# EasyEDA Pro project 学期项目.epro, schematic Schematic2

## Sheets
1 P1: Assembly Variant: Basic; Board Name: Board2; Create Date: 2026-04-07; Page Name: P1; Project Name: 学期项目_2026-03-26_14-34-54; Schematic Name: Schematic2; Update Date: 2026-04-07; BladeWidth: 10; Company: 嘉立创EDA; Page Size: A4; RegionStart: 1; ShowBorder: 1; TitleBlock: 1; TitleBlockPosition: 3; Version: V1.0; XRegionCount: 6; YRegionCount: 4
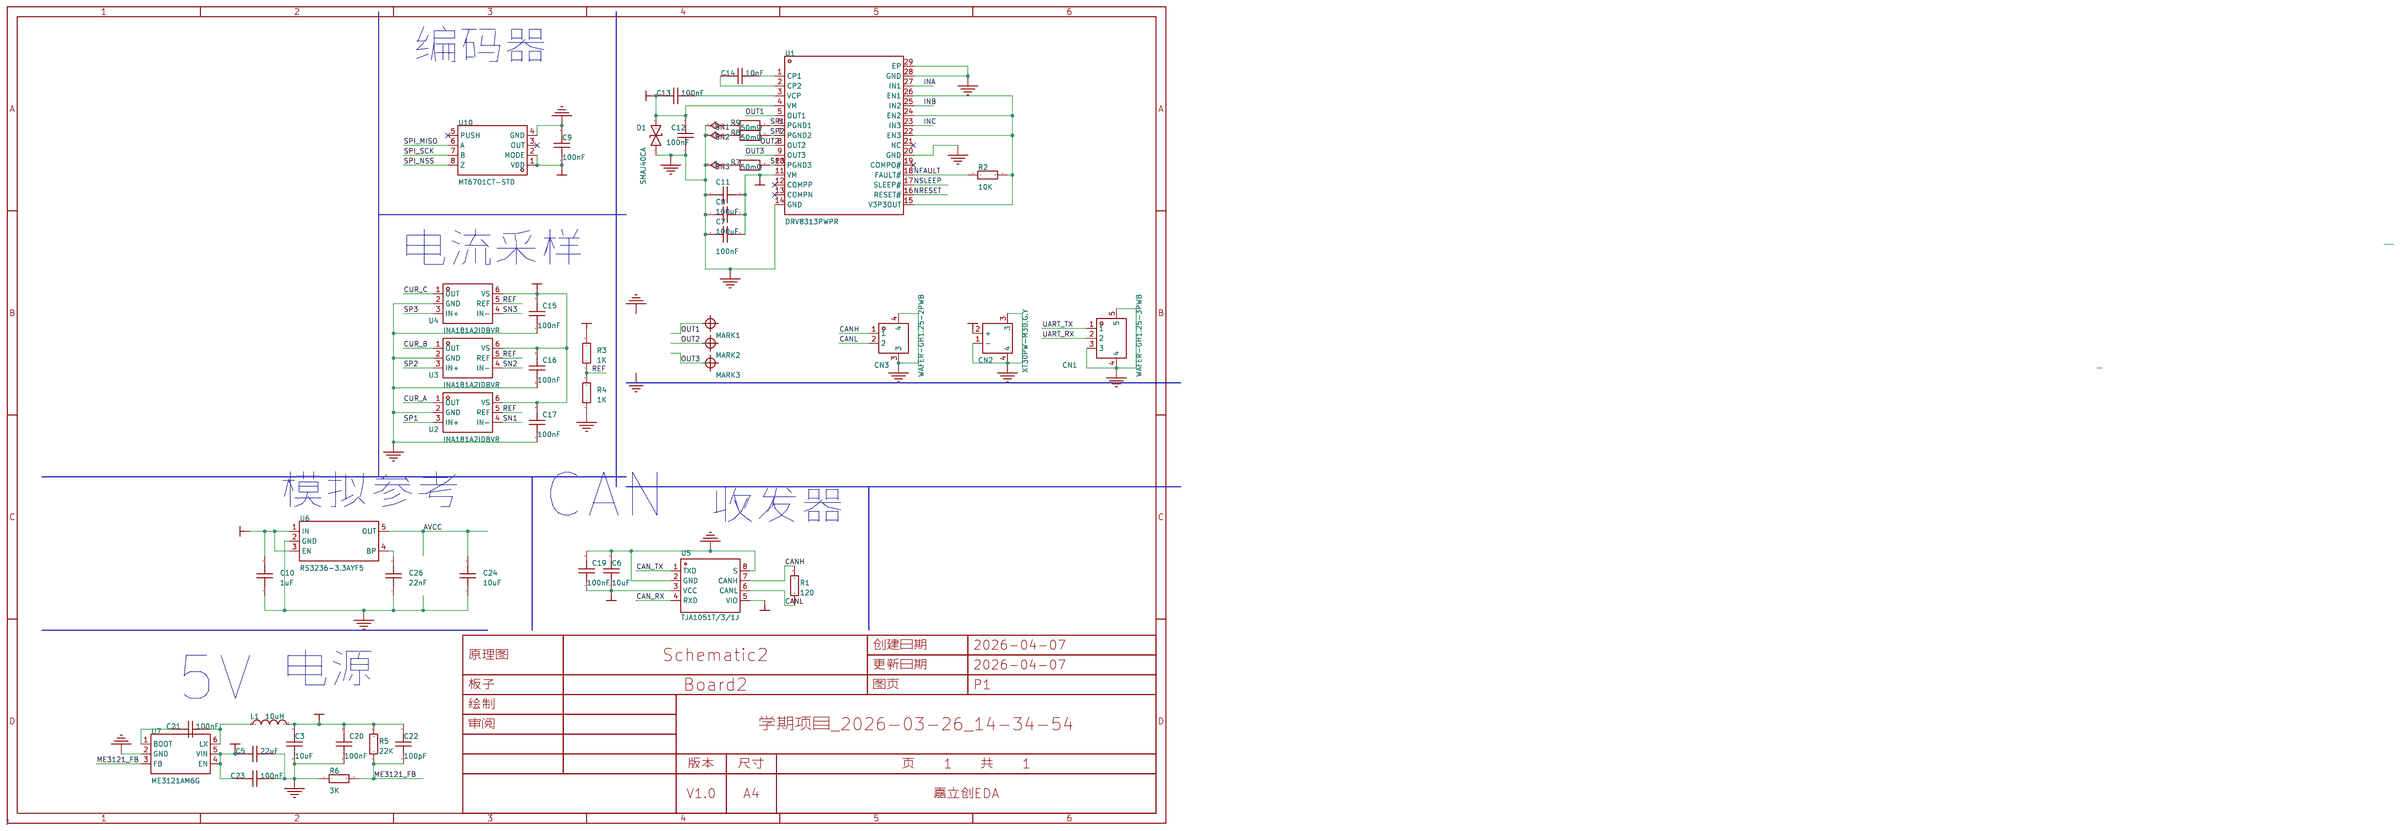
[diagram p6: P1]
2 P3: Page Name: P3
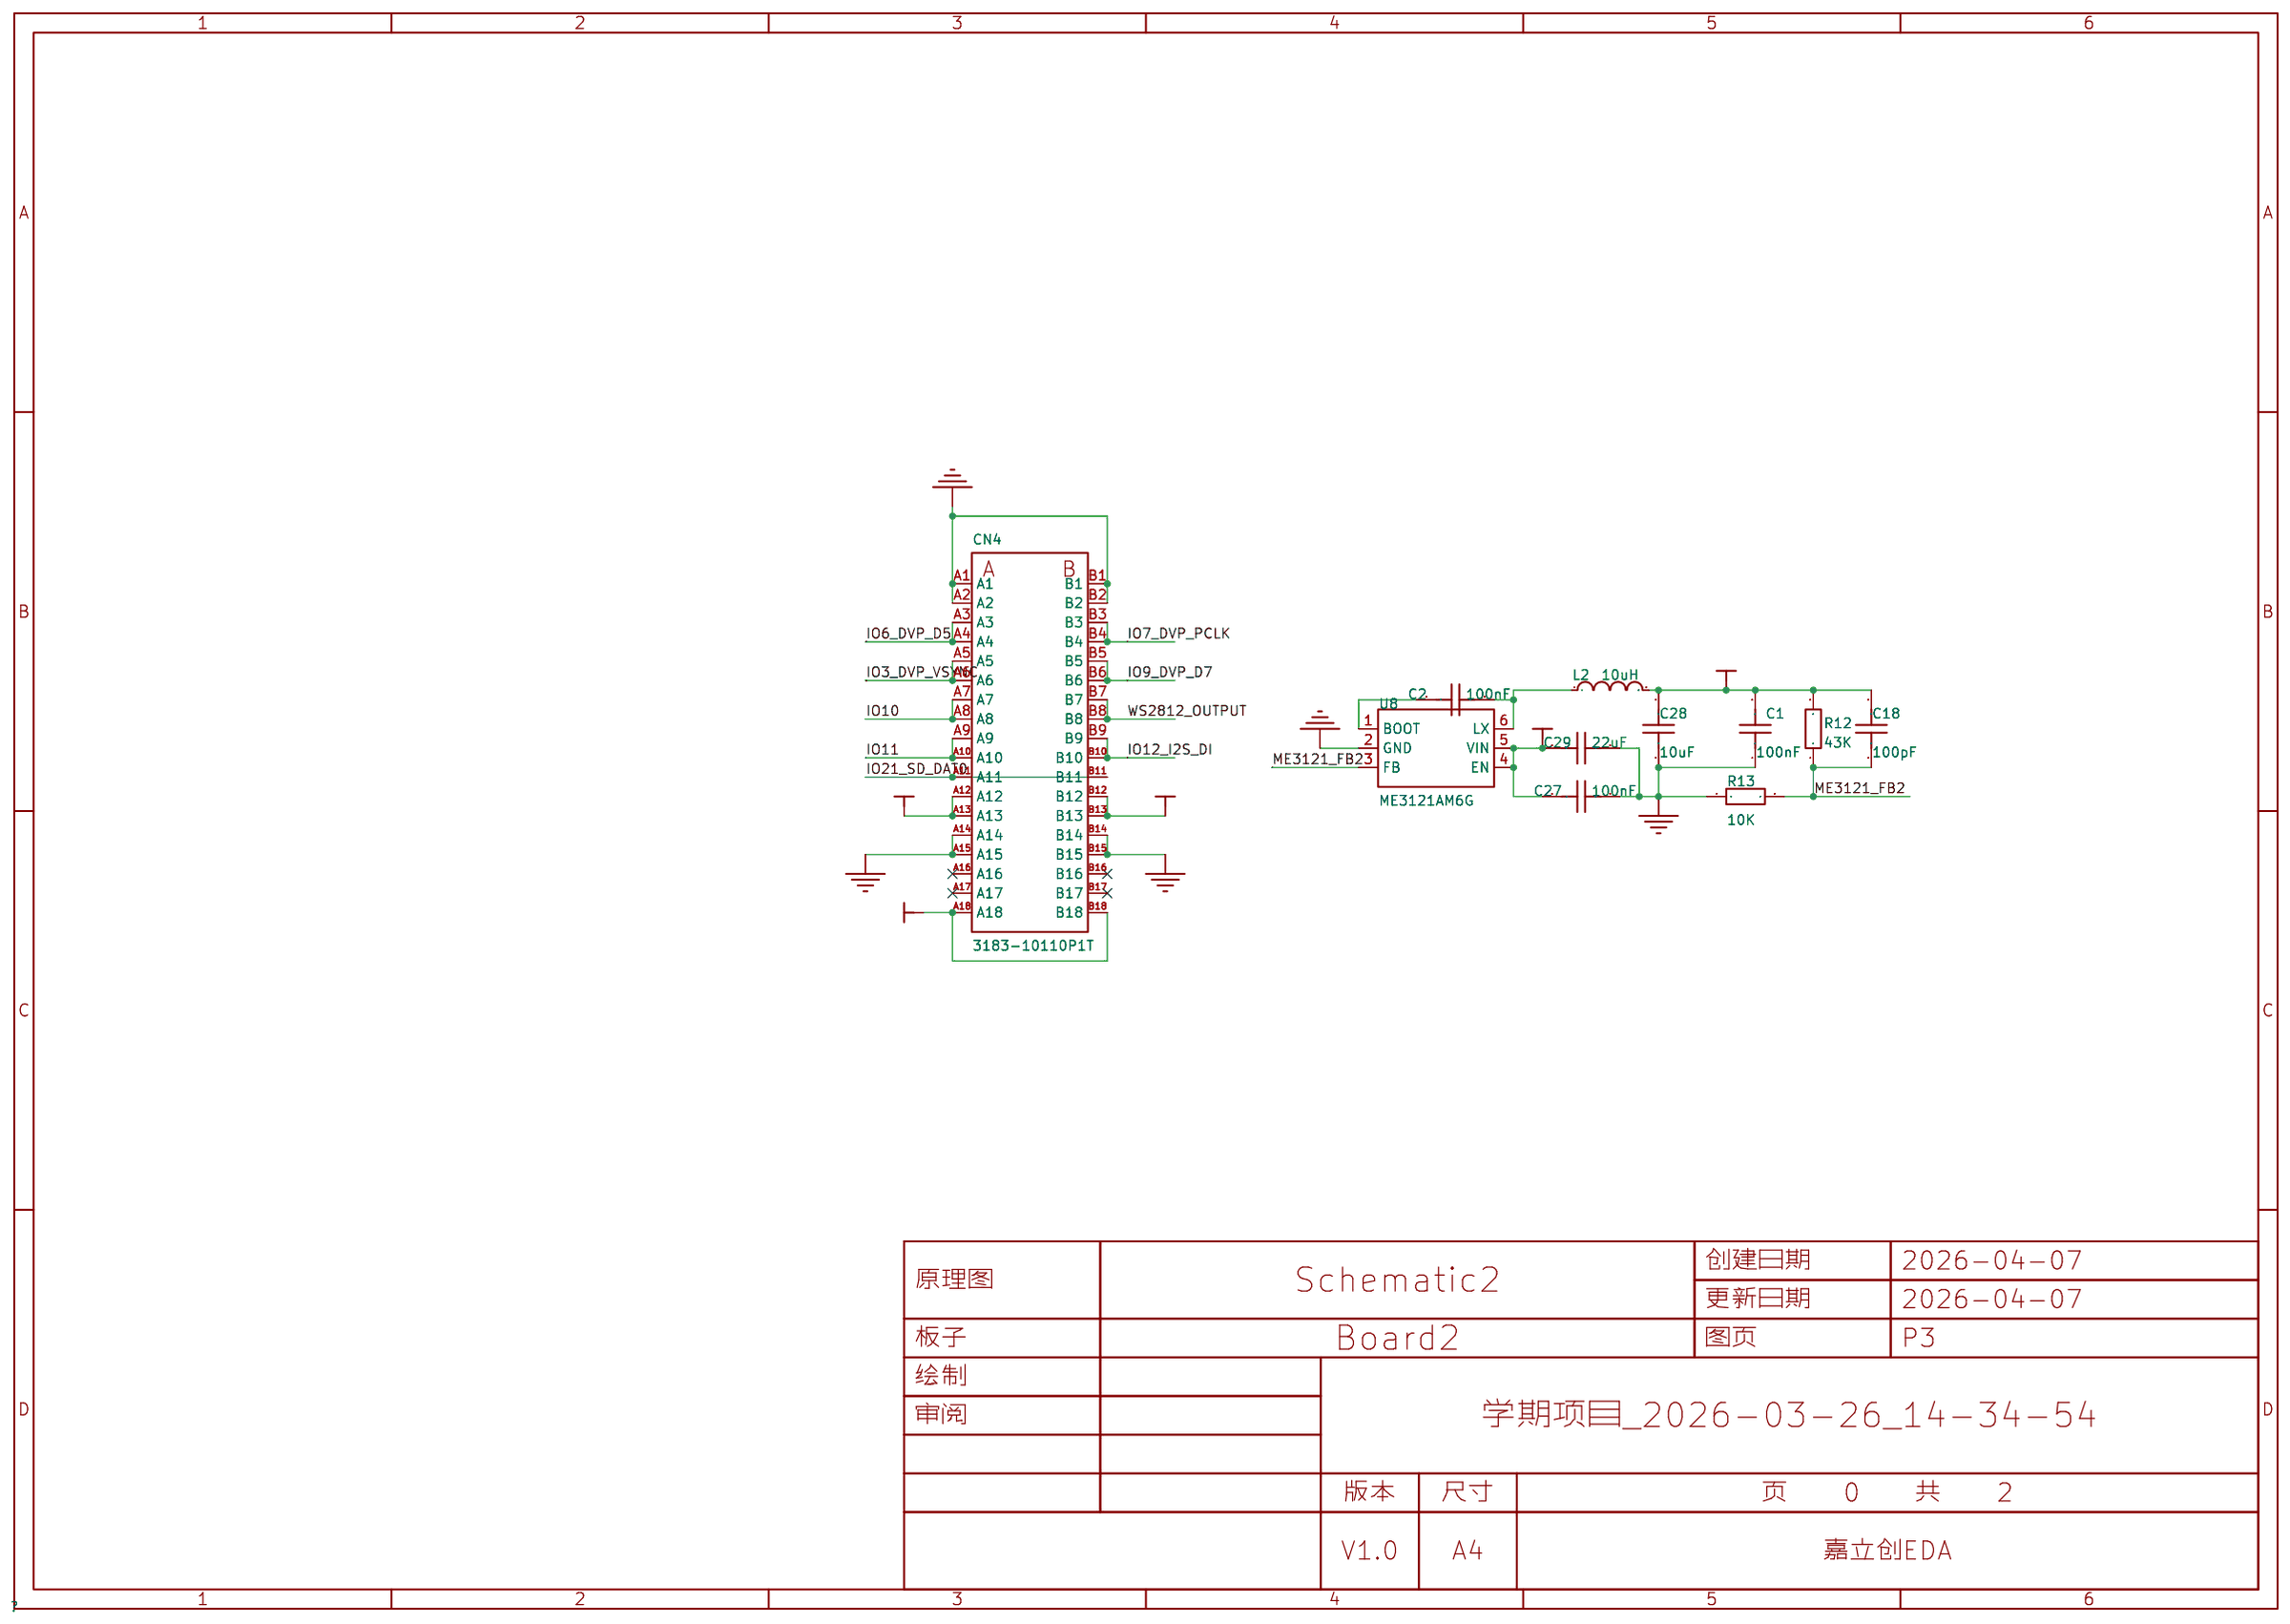
[diagram p7: P3]
3 P2: Page Name: P2
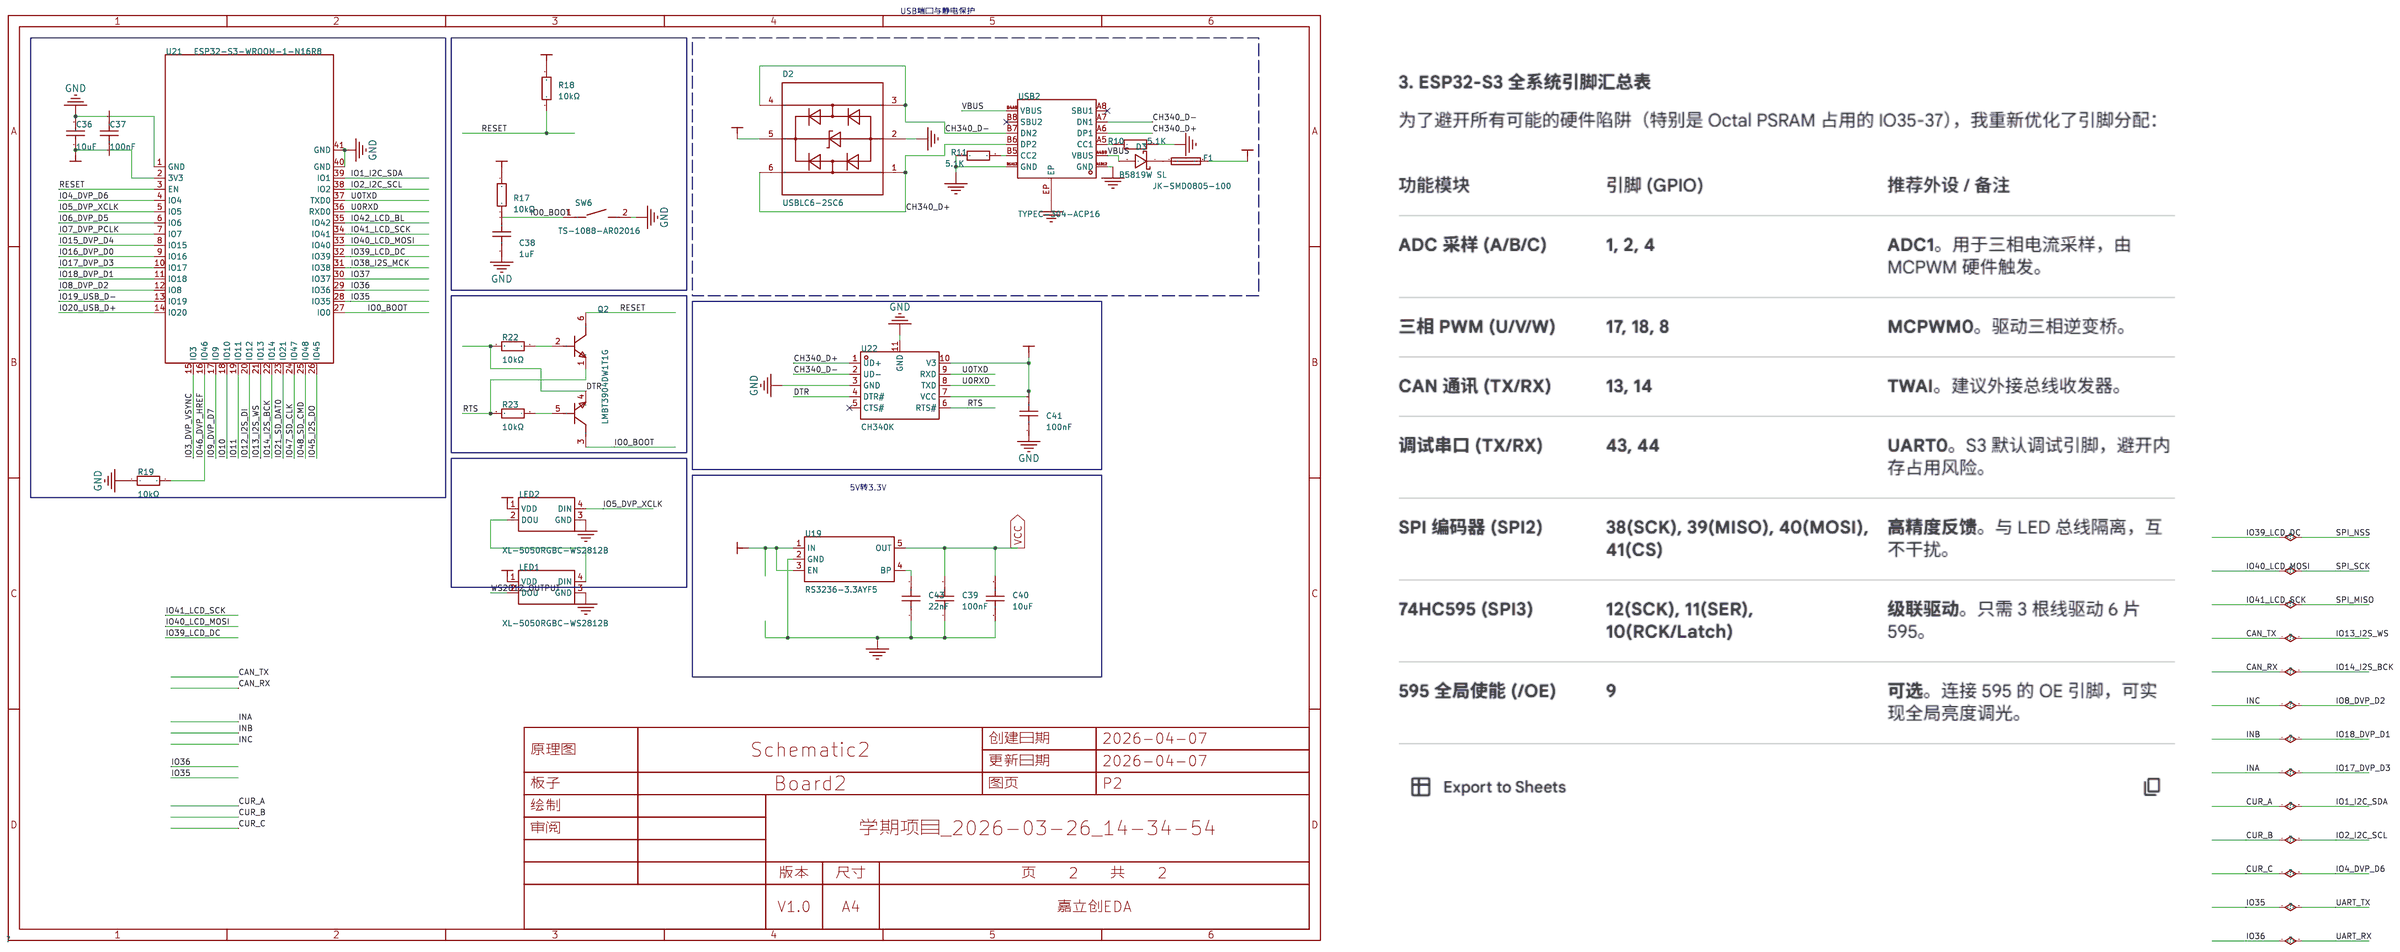
[diagram p8: P2]

## Parts
sheet P1
C3  10uF  [C0603]
C5  22uF  [C0603]
C6  10uF  [C0603]
C7  100nF  [C0603]
C8  100uF  [C1206]
C9  100nF  [C0603]
C10  1uF  [C0603]
C11  100uF  [C1206]
C12  100nF  [C0603]
C13  100nF  [C0603]
C14  10nF  [C0603]
C15  100nF  [C0603]
C16  100nF  [C0603]
C17  100nF  [C0603]
C19  100nF  [C0603]
C20  100nF  [C0603]
C21  100nF  [C0603]
C22  100pF  [C0603]
C23  100nF  [C0603]
C24  100nF  [C0603]
C26  100nF  [C0603]
CN1  WAFER-GH1.25-3PWB  [CONN-TH_3P-P1.25_GH1.25]
CN2  XT30PW-M30.G.Y  [CONN-TH_XT30PW-M]
CN3  WAFER-GH1.25-2PWB  [CONN-TH_2P-P1.25_XUNPU_WAFER-GH1.25-2PWB]
D1  SMAJ40CA  [SMA_L4.3-W2.6-LS5.0-BI]
L1  10uH  [IND-SMD_L4.4-W4.2]
MARK1  -  [Mark-Point-1mm]  (no BOM)
MARK2  -  [Mark-Point-1mm]  (no BOM)
MARK3  -  [Mark-Point-1mm]  (no BOM)
R1  120  [R0603]
R2  10K  [R0603]
R3  1K  [R0603]
R4  1K  [R0603]
R5  22K  [R0603]
R6  3K  [R0603]
R7  50mΩ  [R1206]
R8  50mΩ  [R1206]
R9  50mΩ  [R1206]
U1  DRV8313PWPR  [HTSSOP-28_L9.8-W4.5-P0.65-LS6.6-BL-EP]
U2  INA181A2IDBVR  [SOT-23-6_L2.9-W1.6-P0.95-LS2.8-BL]
U3  INA181A2IDBVR  [SOT-23-6_L2.9-W1.6-P0.95-LS2.8-BL]
U4  INA181A2IDBVR  [SOT-23-6_L2.9-W1.6-P0.95-LS2.8-BL]
U5  TJA1051T/3/1J  [SOIC-8_L4.9-W3.9-P1.27-LS6.0-BL]
U6  RS3236-3.3AYF5  [SOT-23-5_L3.0-W1.7-P0.95-LS2.8-BR]
U7  ME3121AM6G  [SOT-23-6_L2.9-W1.6-P0.95-LS2.8-BR]
U10  MT6701CT-STD  [SOP-8_L4.9-W3.9-P1.27-LS6.0-BL]
sheet P2
C36  10uF  [C0603]
C37  100nF  [C0603]
C38  1uF  [C0603]
C39  100nF  [C0603]
C40  100nF  [C0603]
C41  100nF  [C0603]
C43  100nF  [C0603]
D2  USBLC6-2SC6  [SOT-23-6_L2.9-W1.6-P0.95-LS2.8-BL]
D3  B5819W SL  [SOD-123_L2.7-W1.6-LS3.7-RD-1]
F1  JK-SMD0805-100  [F0805]
LED1  XL-5050RGBC-WS2812B  [LED-SMD_4P-L5.0-W5.0-BL_XL-5050RGBC]
LED2  XL-5050RGBC-WS2812B  [LED-SMD_4P-L5.0-W5.0-BL_XL-5050RGBC]
Q2  LMBT3904DW1T1G  [SOT-363_L2.0-W1.3-P0.65-LS2.1-BR]
R10  5.1K  [R0603]
R11  5.1K  [R0603]
R17  10kΩ  [R0603]
R18  10kΩ  [R0603]
R19  10kΩ  [R0603]
R22  10kΩ  [R0603]
R23  10kΩ  [R0603]
SW6  TS-1088-AR02016  [SW-SMD_L3.9-W3.0-P4.45]
U19  RS3236-3.3AYF5  [SOT-23-5_L3.0-W1.7-P0.95-LS2.8-BR]
U21  ESP32-S3-WROOM-1-N16R8  [WIRELM-SMD_ESP32-S3-WROOM-1]
U22  CH340K  [ESOP-10_L4.9-W3.9-P1.00-LS6.0-BL-EP]
USB2  TYPEC-304-ACP16  [USB-C-SMD_TYPE-C-16P-1_1]
sheet P3
C1  100nF  [C0603]
C2  100nF  [C0603]
C18  100pF  [C0603]
C27  100nF  [C0603]
C28  10uF  [C0603]
C29  22uF  [C0603]
CN4  3183-10110P1T  [CONN-TH_36P-P1.00-V_3183-XXXXXPXT]
L2  10uH  [IND-SMD_L4.4-W4.2]
R12  43K  [R0603]
R13  10K  [R0603]
U8  ME3121AM6G  [SOT-23-6_L2.9-W1.6-P0.95-LS2.8-BR]

## Library data of the parts
C3 C6 C28 = CGA0603X5R106K100JT: 容值:10uF;精度:±10%;额定电压:10V;温度系数:X5R;; LCSC Part Name: 10uF ±10% 10V; Supplier Part: C6119842; Manufacturer: HRE(芯声); Supplier Footprint: 0603; JLCPCB Part Class: Extended Part; Supplier: LCSC; Tolerance: ±10%; Voltage Rating: 10V; Temperature Coefficient: X5R
C5 C29 = CL10A226MO7JZNC: 容值:22uF;精度:±20%;额定电压:16V;温度系数:X5R;; LCSC Part Name: 22uF ±20% 16V; Supplier Part: C2762594; Manufacturer: SAMSUNG(三星); Supplier Footprint: 0603; JLCPCB Part Class: Extended Part; Datasheet: https://item.szlcsc.com/datasheet/CL10A226MO7JZNC/2889856.html; Supplier: LCSC; Tolerance: ±20%; Voltage Rating: 16V; Temperature Coefficient: X5R
C1 C2 C7 C9 C10 C12-C24 C26 C27 C39 C40 C43 = CAP_0603: Supplier Footprint: 0603
C8 C11 = CAP_1206: Supplier Footprint: 1206
CN1 = WAFER-GH1.25-3PWB: 插针结构:1x3P;间距:1.25mm;安装方式:卧贴;参考系列:GH;总PIN数:3P;排数:1;每排PIN数:3;行距:-;额定电流:1A;触头材质:黄铜;触头镀层:-;工作温度范围:-25℃~+85℃;; LCSC Part Name: 1x3P 间距:1.25mm 卧贴 系列:GH; Supplier Part: C3029378; Manufacturer: XUNPU(讯普); Supplier Footprint: SMD,P=1.25mm,卧贴; JLCPCB Part Class: 扩展库; Datasheet: https://atta.szlcsc.com/upload/public/pdf/source/20220527/CB8773BFB0913C3B8ABD62CB38BA101A.pdf; Supplier: LCSC; Pins Structure: 1x3P; Pitch: 1.25mm; Mounting Type: 卧贴; Reference Series: GH; Number of Pins: 3P; Number of Rows: 1; Number of PINs Per Row: 3; Current Rating: 1A; Contact Material: 黄铜; Operating Temperature: -25℃~+85℃; Voltage Rating: 125V; Plastic Material: LCP; Supplementary Features: 辅助焊脚; Color: 米色; Z-Height of the Board: 4.35mm; X-Length of Bottom Edge on Board (Spacing Line): 7mm; Y-Width of Bottom Edge on Board: 5mm
CN2 = XT30PW-M30.G.Y: 类别:-;类型1:-;; LCSC Part Name: AMASS(艾迈斯)航模插头 卧式弯脚 XT30PW-M公头; Supplier Part: C431092; Manufacturer: AMASS(艾迈斯); JLCPCB Part Class: 扩展库; Datasheet: https://atta.szlcsc.com/upload/public/pdf/source/20220222/6A9F22F7850E25B33E1BE430ADF8560B.pdf; Supplier: LCSC; Type: 航模插头; RatedVoltage: DC 500V; InterfaceType: 公头; RatedCurrent: 15A; RecommendedWireGauge: 16/18/20AWG; contact resistance: 1.2mΩ; specifications: 2pin
CN3 = WAFER-GH1.25-2PWB: 插针结构:1x2P;间距:1.25mm;安装方式:卧贴;参考系列:GH;总PIN数:2P;排数:1;每排PIN数:2;行距:-;额定电流:1A;触头材质:黄铜;触头镀层:-;工作温度范围:-25℃~+85℃;; LCSC Part Name: 1x2P 间距:1.25mm 卧贴 系列:GH; Supplier Part: C3029377; Manufacturer: XUNPU(讯普); Supplier Footprint: SMD,P=1.25mm,卧贴; JLCPCB Part Class: 扩展库; Datasheet: https://atta.szlcsc.com/upload/public/pdf/source/20220527/CB8773BFB0913C3B8ABD62CB38BA101A.pdf; Supplier: LCSC; Pins Structure: 1x2P; Pitch: 1.25mm; Mounting Type: 卧贴; Reference Series: GH; Number of Pins: 2P; Number of Rows: 1; Number of PINs Per Row: 2; Current Rating: 1A; Contact Material: 黄铜; Operating Temperature: -25℃~+85℃; Voltage Rating: 125V; Plastic Material: LCP; Supplementary Features: 辅助焊脚; Color: 米色; Z-Height of the Board: 4.35mm; X-Length of Bottom Edge on Board (Spacing Line): 5.75mm; Y-Width of Bottom Edge on Board: 5mm
D1 = SMAJ40CA_C223989: 反向截止电压(Vrwm):40V;最大钳位电压:64.5V;峰值脉冲电流(Ipp):6.2A;峰值脉冲功率(Ppp):400W;击穿电压:44.4V;; LCSC Part Name: 双向TVS 40V截止 6.2A峰值脉冲; Supplier Part: C223989; Manufacturer: Littelfuse(美国力特); Supplier Footprint: SMA(DO-214AC); JLCPCB Part Class: 扩展库; Datasheet: https://atta.szlcsc.com/upload/public/pdf/source/20190402/C374025_5ACE77BC72947DF13CF0CBC7F8B57228.pdf; Supplier: LCSC; Reverse Stand-Off Voltage (Vrwm): 40V; Maximum Clamping Voltage: 64.5V; Peak Pulse Current (Ipp): 6.2A; Peak Pulse Power Dissipation (Ppp): 400W; Breakdown Voltage: 44.4V; Type: TVS
L1 L2 = FXL0420-100-M: 电感值:10uH;精度:±20%;额定电流:1.6A;饱和电流(Isat):2.2A;类型:一体成型电感;; LCSC Part Name: 10uH ±20% 2.2A; Supplier Part: C177242; Manufacturer: cjiang(长江微电); Supplier Footprint: SMD,4.2x4.4mm; JLCPCB Part Class: 扩展库; Datasheet: https://atta.szlcsc.com/upload/public/pdf/source/20240426/3189EA8206330E2108542F9E34E540E7.pdf; Supplier: LCSC; Tolerance: ±20%; Rated Current: 1.6A; Saturation Current (Isat): 2.2A; DC Resistance (DCR): 282mΩ; Type: 一体成型电感
MARK1-MARK3 = Mark-Point: Mark点
R1-R6 R12 R13 = Res_0603: Supplier Footprint: 0603
R7-R9 = RE1206F1R050: 电阻类型:采样电阻;阻值:50mΩ;精度:±1%;功率:1W;温度系数:±50ppm/℃;; LCSC Part Name: 50mΩ 1W 1206 ±1%; Supplier Part: C46961736; Manufacturer: 捷而瑞; Supplier Footprint: 1206; JLCPCB Part Class: 扩展库; Datasheet: https://atta.szlcsc.com/upload/public/pdf/source/20250325/401775B85EF7B3A580BC34DFED100CB2.pdf; Supplier: LCSC; Type: 采样电阻; Tolerance: ±1%; Power(Watts): 1W; Temperature Coefficient: ±50ppm/℃
U1 = DRV8313PWPR: DRV8313 具有集成 FET、65V 最大电压、3A 峰值电流的三相电机驱动器; LCSC Part Name: 无刷直流BLDC电机驱动芯片 60V; Supplier Part: C92482; Manufacturer: TI(德州仪器); Supplier Footprint: HTSSOP-28; JLCPCB Part Class: Extended Part; Datasheet: https://www.ti.com/cn/lit/gpn/drv8313; Supplier: LCSC; Drive Type: 三相; Integrated FETs: 是; Number of Half Bridges: 3; Peak Current: 2.5A; Quiescent Current(Iq): 800uA; Operating Temperature: -40℃~+125℃
U2-U4 = INA181A2IDBVR: 放大器数:单路;; Supplier Part: C2058784; Manufacturer: TI(德州仪器); Supplier Footprint: SOT-23-6; JLCPCB Part Class: 扩展库; Datasheet: https://www.ti.com/cn/lit/gpn/ina2181; Supplier: LCSC; Number of Channels: 单路; Supply Current: 260uA; Operating Temperature: -40℃~+125℃
U5 = TJA1051T/3/1J: 类型:-;数据速率:5Mbps;; Supplier Part: C38695; Manufacturer: NXP(恩智浦); Supplier Footprint: SOIC-8-150mil; JLCPCB Part Class: Extended Part; Datasheet: https://www.nxp.com/docs/en/data-sheet/TJA1051.pdf; Supplier: LCSC; Data Rate: 5Mbps; Supply Voltage: 4.5V~5.5V; Supply Current: 5mA; Operating Temperature: -40℃~+150℃
U6 U19 = RS3236-3.3AYF5: 输出类型:固定;工作电压:7.5V;输出电压:3.3V;输出电流:500mA;电源纹波抑制比(PSRR):74dB@(217Hz);输出极性:正极;; Supplier Part: C2913557; Manufacturer: RUNIC(润石); Supplier Footprint: SOT-23-5; JLCPCB Part Class: 扩展库; Datasheet: https://atta.szlcsc.com/upload/public/pdf/source/20211119/36BE441864376B022A326601AD3750E6.pdf; Supplier: LCSC; Output Type: 固定; Voltage - Supply: 7.5V; Output Voltage: 3.3V; Output Current: 500mA; Power Supply Rejection Ratio (PSRR): 74dB@(217Hz); Features: 防静电保护；低ESR；热关断(TSD)；过流保护(OCP)；带使能; Operating Temperature: -40℃~+85℃@(Ta); Output Configuration: 正极; Number of Outputs: 1
U7 U8 = ME3121AM6G: 功能类型:降压型;输出类型:可调;工作电压:4.7V~40V;输出电压:-;输出电流:-;; LCSC Part Name: 40V输入1A负载同步整流降压DC-DC转换器; Supplier Part: C2932938; Manufacturer: MICRONE(南京微盟); Supplier Footprint: SOT-23-6; JLCPCB Part Class: 扩展库; Datasheet: https://atta.szlcsc.com/upload/public/pdf/source/20220331/EB46EBF6ED46F90696A7B4CB82ED1A1E.pdf; Supplier: LCSC; Function: 降压型; Output Type: 可调; Voltage - Supply: 4.7V~40V; Frequency - Switching: 1MHz; Operating Temperature: -40℃~+85℃; Synchronous Rectifier: 是; Number of Outputs: 1; Topology: 降压式; Quiescent Current: 120uA; Switch tube (built-in/external): 内置
U10 = MT6701CT-STD_C5451785: Supplier Part: C5451785; Manufacturer: MagnTek(麦歌恩); Supplier Footprint: SOP-8; JLCPCB Part Class: Extended Part; Datasheet: https://item.szlcsc.com/datasheet/MT6701CT-STD/6356029.html; Supplier: LCSC
C36 = CL05A106MQ5NUNC: 容值:10uF;精度:±20%;额定电压:6.3V;材质(温度系数):X5R;; LCSC Part Name: 10uF ±20% 6.3V; Supplier Part: C15525; Manufacturer: SAMSUNG(三星); Supplier Footprint: 0402; Datasheet: https://atta.szlcsc.com/upload/public/pdf/source/20220823/2B02EE04F8F211D38A52DCB16EB6BEBA.pdf; Supplier: LCSC; Tolerance: ±20%; Voltage Rated: 6.3V; Temperature Coefficient: X5R; Check: true
C37 = CGA0603X7R104K500JT: 容值:100nF;精度:±10%;额定电压:50V;温度系数:X7R;; LCSC Part Name: 100nF ±10% 50V; Supplier Part: C6119867; Manufacturer: HRE(芯声); Supplier Footprint: 0603; JLCPCB Part Class: Extended Part; Datasheet: https://atta.szlcsc.com/upload/public/pdf/source/20250103/C44077DA9E7B3EFAE02F22B6D3D1CBC9.pdf; Supplier: LCSC; Tolerance: ±10%; Voltage Rating: 50V; Temperature Coefficient: X7R
C38 = CL05B104KO5NNNC: 容值:100nF;精度:±10%;额定电压:16V;材质(温度系数):X7R;; LCSC Part Name: 100nF ±10% 16V; Supplier Part: C52923; Manufacturer: SAMSUNG(三星); Manufacturer Part: CL05A105KA5NQNC; Supplier Footprint: 0402; Datasheet: https://atta.szlcsc.com/upload/public/pdf/source/20160218/1457707763339.pdf; Supplier: LCSC; Tolerance: ±10%; Voltage Rated: 16V; Temperature Coefficient: X7R; Check: true
C41 = CL05B104KO5NNNC: 容值:100nF;精度:±10%;额定电压:16V;材质(温度系数):X7R;; LCSC Part Name: 100nF ±10% 16V; Supplier Part: C1525; Manufacturer: SAMSUNG(三星); Supplier Footprint: 0402; Datasheet: https://atta.szlcsc.com/upload/public/pdf/source/20160218/1457707763339.pdf; Supplier: LCSC; Tolerance: ±10%; Voltage Rated: 16V; Temperature Coefficient: X7R; Check: true
D2 = USBLC6-2SC6_C7519: 极性:单向;反向截止电压(Vrwm):5.25V;钳位电压:17V;峰值脉冲电流(Ipp):5A;击穿电压:6V;; LCSC Part Name: 单向ESD; Supplier Part: C7519; Manufacturer: ST(意法半导体); Supplier Footprint: SOT-23-6L; JLCPCB Part Class: Extended Part; Datasheet: https://item.szlcsc.com/datasheet/USBLC6-2SC6/7996.html; Supplier: LCSC; polarity: 单向; Reverse Stand-Off Voltage (Vrwm): 5.25V; Maximum Clamping Voltage: 17V; Peak Pulse Current (Ipp)@10/1000us: 5A; Breakdown Voltage: 6V; Number of Lines: 双路; Operating Temperature: -40℃~+125℃; Type: ESD; Polarity: 单向; Clamping Voltage: 17V; Peak Pulse Current (Ipp): 5A; Voltage - Breakdown: 6V; Reverse Leakage Current (Ir): 150nA; Number of Channels: 双路; level of protection: IEC 61000-4-2; Junction Capacitance: 3.5pF
D3 = B5819W SL: 正向压降(Vf):600mV@1A;直流反向耐压(Vr):40V;整流电流:1A;; LCSC Part Name: 电压:40V 电流:1A; Supplier Part: C8598; Manufacturer: CJ(江苏长电/长晶); Supplier Footprint: SOD-123; JLCPCB Part Class: 基础库; Datasheet: https://item.szlcsc.com/datasheet/B5819W%2520SL/9093.html; Supplier: LCSC; Voltage - Forward(Vf@If): 600mV@1A; Voltage - DC Reverse(Vr): 40V; Current - Rectified: 1A; Non-Repetitive Peak Forward Surge Current: 9A
F1 = JK-SMD0805-100: 耐压:6V;最大电流:100A;保持电流(Ih):1A;跳闸电流:1.95A;; LCSC Part Name: 6V 1A 0805自恢复; Supplier Part: C369152; Manufacturer: JK(金科); Supplier Footprint: 0805; JLCPCB Part Class: 扩展库; Datasheet: https://atta.szlcsc.com/upload/public/pdf/source/20190306/C369151_789C15D625FD73830E24950182550D65.pdf; Supplier: LCSC; Voltage - Max: 6V; Current - Max: 100A; Hold Current: 1A; Trip Current: 1.95A; Time to Trip(Max): 300ms
LED1 LED2 = XL-5050RGBC-WS2812B: 5050七彩幻彩透明贴片LED灯珠 5050 幻彩透明四脚 ws2812B 内置驱动IC; Supplier Part: C2843785; Manufacturer: XINGLIGHT(成兴光); Supplier Footprint: SMD5050; JLCPCB Part Class: 扩展库; Datasheet: https://atta.szlcsc.com/upload/public/pdf/source/20240412/E1004CAA80592E31D08BFE019083806F.pdf; Supplier: LCSC
Q2 = LMBT3904DW1T1G: 晶体管类型:2个NPN;集射极击穿电压(Vceo):40V;集电极电流(Ic):200mA;功率(Pd):150mW;直流电流增益(hFE@Ic,Vce):100@10mA,1V;; Supplier: LCSC; Manufacturer: LRC(乐山无线电); Supplier Part: C131781; LCSC Part Name: 2个NPN 耐压:40V 电流:200mA; Supplier Footprint: SC-88; Datasheet: https://atta.szlcsc.com/upload/public/pdf/source/20170918/C131781_1505703476125975491.pdf; Transistor Type: 2个NPN; Collector-Emitter Breakdown Voltage (Vceo): 40V; Collector Current (Ic): 200mA; Power Dissipation (Pd): 150mW; Collector-Emitter Saturation Voltage (VCE(sat)@Ic,Ib): 300mV@50mA,5mA; DC Current Gain (hFE@Ic,Vce): 100@10mA,1V; Transition Frequency (fT): 300MHz; Operating Temperature: -55℃~+150℃@(Tj); Check: true
R10 R11 = Res_0603: Supplier Footprint: 0603; Check: false
R17-R19 R22 R23 = 0402WGF1002TCE: 电阻类型:厚膜电阻;阻值:10kΩ;精度:±1%;功率:62.5mW;温度系数:±100ppm/℃;; LCSC Part Name: 厚膜电阻 10kΩ ±1% 62.5mW; Supplier Part: C25744; Manufacturer: UNI-ROYAL(厚声); Supplier Footprint: 0402; Datasheet: https://atta.szlcsc.com/upload/public/pdf/source/20200306/C422600_1E6D84923E4A46A82E41ADD87F860B5C.pdf; Supplier: LCSC; Type: 厚膜电阻; Tolerance: ±1%; Power(Watts): 62.5mW; Temperature Coefficient: ±100ppm/℃; Overload Voltage (Max): 50V; Operating Temperature Range: -55℃~+155℃; Check: true
SW6 = TS-1088-AR02016: 电路结构:单刀单掷;按钮形状:圆形按钮;作用力:160gf;安装方式:立贴;开关长度:4mm;开关宽度:3mm;开关高度:2mm;带支架:不带;触点电流:50mA;额定电压(DC):12V;绝缘电阻:100MΩ;机械寿命:10万次;; LCSC Part Name: 4*3*2mm 立贴 轻触开关; Supplier Part: C720477; Manufacturer: XUNPU(讯普); Supplier Footprint: SMD; JLCPCB Part Class: 基础库; Datasheet: https://atta.szlcsc.com/upload/public/pdf/source/20200810/C720475_60D09DD6C54279ADDB2DC25100F1CC11.pdf; Supplier: LCSC; Circuit: 单刀单掷; Actuator Style: 圆形按钮; Operating Force: 160gf; Mounting Style: 立贴; Switch Length: 4mm; Switch Width: 3mm; Switch Height: 2mm; Strike Gundam: 不带; Contact Current: 50mA; Voltage Rating (DC): 12V; Insulation Resistance: 100MΩ; Actuator/Cap Color: 黑色; Pin Style: SMD接片; Mechanical Life: 10万次; Operating Temperature: -30℃~+80℃
U21 = ESP32-S3-WROOM-1-N16R8: LCSC Part Name: 通用型Wi-Fi+低功耗蓝牙MCU模组; Supplier Part: C2913202; Manufacturer: ESPRESSIF(乐鑫); Supplier Footprint: SMD,18x25.5mm; JLCPCB Part Class: 扩展库; Datasheet: https://atta.szlcsc.com/upload/public/pdf/source/20241030/6A412B13087E1327DF6279F5735253CA.pdf; Supplier: LCSC; Check: true
U22 = CH340K_C18208922: LCSC Part Name: CH340K 人工转编带; Supplier Part: C18208922; Manufacturer: WCH(南京沁恒); Supplier Footprint: ESSOP-10-150mil-1mm; JLCPCB Part Class: 扩展库; Datasheet: https://atta.szlcsc.com/upload/public/pdf/source/20240313/9D833A30DDFD16C064A7ADE10A944019.pdf; Supplier: LCSC; Check: true
USB2 = TYPEC-304-ACP16_1: Type-C 母座 卧贴 板上型 16PIN L7.35; Supplier Part: C2982555; Manufacturer: XUNPU(讯普); Supplier Footprint: SMD; JLCPCB Part Class: Extended Part; Datasheet: https://atta.szlcsc.com/upload/public/pdf/source/20220311/3C907F75E12F45E4EE7F73565AB9C294.pdf; Supplier: LCSC
CN4 = 3183-10110P1T: PCIE3.0 DIP连接器 带双定位柱 卡边缘插槽; LCSC Part Name: 黑色 PCIE3.0 DIP连接器 带双定位柱 卡边缘插槽; Supplier Part: C404109; Manufacturer: UMaxconn(友贸); Supplier Footprint: 插件,P=1mm; JLCPCB Part Class: Extended Part; Datasheet: https://item.szlcsc.com/datasheet/3183-10110P1T/391111.html; Supplier: LCSC; Number of Pins: 36P; Number of Data Pins: 142P; Mounting Type: 直插; Versions: PCI-E 3.0; Height Above Board: 11.25mm; Supplementary Features: 带柱; Operating Temperature: -40℃~+85℃

## Nets
+5V: C3.2 C6.1 C10.2 C19.1 C20.2 C22.2 F1.2 L1.2 R5.2 U5.3(VCC) U6.1(IN) U6.3(EN) U19.1(IN) U19.3(EN)
AVCC: C15.2 C16.2 C17.2 C24.2 R3.2 U2.6(VS) U3.6(VS) U4.6(VS) U6.5(OUT)
GND: C1.1 C3.1 C5.1 C6.2 C7.2 C8.1 C9.2 C10.1 C11.1 C12.1 C15.1 C16.1 C17.1 C19.2 C20.1 C23.1 C24.1 C26.1 C27.1 C28.1 C29.1 C36.2 C39.1 C40.1 C43.1 CN1.3 CN1.4 CN1.5 CN2.1(-) CN2.3 CN2.4 CN3.3 CN3.4 CN4.A1 CN4.A2 CN4.A14 CN4.A15 CN4.B1 CN4.B2 CN4.B14 CN4.B15 D1.1 D2.2 LED1.3(GND) LED2.3(GND) R4.1 R6.1 R7.2 R8.2 R9.2 R10.1 R11.1 R13.1 R19.1 SW6.2 U1.14(GND) U1.20(GND) U1.28(GND) U1.29(EP) U2.2(GND) U2.4(IN-) U3.2(GND) U3.4(IN-) U4.2(GND) U4.4(IN-) U5.2(GND) U5.8(S) U6.2(GND) U7.2(GND) U8.2(GND) U10.4(GND) U19.2(GND) U21.1(GND) U21.40(GND) U21.41(GND) U22.3(GND) U22.11(GND) USB2.A1B12(GND) USB2.B1A12(GND) USB2.EP
PVCC: C5.2 C7.1 C8.2 C11.2 C12.2 C13.1 C23.2 C27.2 C29.2 CN2.2(+) CN4.A18 CN4.B18 D1.2 U1.4(VM) U1.11(VM) U7.4(EN) U7.5(VIN) U8.4(EN) U8.5(VIN)
VBUS: D3.2(+) USB2.A4B9(VBUS) USB2.B4A9(VBUS)
VCC: C9.1 C36.1 C39.2 C40.2 C41.2 LED1.1(VDD) LED2.1(VDD) R17.1 R18.1 U5.5(VIO) U10.1(VDD) U10.2(MODE) U19.5(OUT) U21.2(3V3) U22.7(VCC) U22.10(V3)
CAN_RX: U5.4(RXD) U21.22(IO14)
CAN_TX: U5.1(TXD) U21.21(IO13)
CANH: CN3.1 R1.2 U5.7(CANH)
CANL: CN3.2 R1.1 U5.6(CANL)
CH340_D+: D2.1 D2.6 U22.1(UD+) USB2.A6(DP1) USB2.B6(DP2)
CH340_D-: D2.3 D2.4 U22.2(UD-) USB2.A7(DN1) USB2.B7(DN2)
CUR_A: U2.1(OUT) U21.39(IO1)
CUR_B: U3.1(OUT) U21.38(IO2)
CUR_C: U4.1(OUT) U21.4(IO4)
DTR: Q2.4(E) R22.2 U22.4(DTR#)
INA: U1.27(IN1) U21.10(IO17)
INB: U1.25(IN2) U21.11(IO18)
INC: U1.23(IN3) U21.12(IO8)
IO0_BOOT: Q2.3(C) R17.2 SW6.1 U21.27(IO0)
IO3_DVP_VSYNC: CN4.A5 CN4.A6 U21.15(IO3)
IO5_DVP_XCLK: LED2.4(DIN) U21.5(IO5)
IO6_DVP_D5: CN4.A3 CN4.A4 U21.6(IO6)
IO7_DVP_PCLK: CN4.B3 CN4.B4 U21.7(IO7)
IO9_DVP_D7: CN4.B5 CN4.B6 U21.17(IO9)
IO10: CN4.A7 CN4.A8 U21.18(IO10)
IO11: CN4.A9 CN4.A10 U21.19(IO11)
IO12_I2S_DI: CN4.B9 CN4.B10 U21.20(IO12)
IO15_DVP_D4: U21.8(IO15)
IO16_DVP_D0: U21.9(IO16)
IO19_USB_D-: U21.13(IO19)
IO20_USB_D+: U21.14(IO20)
IO21_SD_DAT0: CN4.A11 CN4.B11 U21.23(IO21)
IO35: CN1.1 U21.28(IO35)
IO36: CN1.2 U21.29(IO36)
IO37: U21.30(IO37)
IO38_I2S_MCK: U21.31(IO38)
IO39_LCD_DC: U10.8(Z) U21.32(IO39)
IO40_LCD_MOSI: U10.7(B) U21.33(IO40)
IO41_LCD_SCK: U10.6(A) U21.34(IO41)
IO42_LCD_BL: U21.35(IO42)
IO45_I2S_DO: U21.26(IO45)
IO46_DVP_HREF: R19.2 U21.16(IO46)
IO47_SD_CLK: U21.24(IO47)
IO48_SD_CMD: U21.25(IO48)
LIGHTVCC: C1.2 C18.2 C28.2 CN4.A12 CN4.A13 CN4.B12 CN4.B13 L2.2 R12.2
ME3121_FB: C22.1 R5.1 R6.2 U7.3(FB)
ME3121_FB2: C18.1 R12.1 R13.2 U8.3(FB)
NFAULT: R2.1 U1.18(FAULT#)
NRESET: U1.16(RESET#)
NSLEEP: U1.17(SLEEP#)
OUT1: MARK1.1 U1.5(OUT1)
OUT2: MARK2.1 U1.8(OUT2)
OUT3: MARK3.1 U1.9(OUT3)
REF: R3.1 R4.2 U2.5(REF) U3.5(REF) U4.5(REF)
RESET: Q2.6(C) R18.2 U21.3(EN)
RTS: Q2.1(E) R23.2 U22.6(RTS#)
SP1: R9.1 U1.6(PGND1) U2.3(IN+)
SP2: R8.1 U1.7(PGND2) U3.3(IN+)
SP3: R7.1 U1.10(PGND3) U4.3(IN+)
U0RXD: U21.36(RXD0) U22.8(TXD)
U0TXD: U21.37(TXD0) U22.9(RXD)
USB5V: D2.5
WS2812_OUTPUT: CN4.B7 CN4.B8 LED1.2(DOU)
$3N7: C2.2 U8.1(BOOT)
$3N8: C2.1 L2.1 U8.6(LX)
Net-(C13-2): C13.2 U1.3(VCP)
Net-(C14-1): C14.1 U1.2(CP2)
Net-(C14-2): C14.2 U1.1(CP1)
Net-(C21-1): C21.1 L1.1 U7.6(LX)
Net-(C21-2): C21.2 U7.1(BOOT)
Net-(C26-2): C26.2 U6.4(BP)
Net-(C43-2): C43.2 U19.4(BP)
Net-(D3-1): D3.1(-) F1.1
Net-(LED1-4): LED1.4(DIN) LED2.2(DOU)
Net-(Q2-2): Q2.2(B) R22.1
Net-(Q2-5): Q2.5(B) R23.1
Net-(R2-2): R2.2 U1.15(V3P3OUT) U1.22(EN3) U1.24(EN2) U1.26(EN1)
Net-(R10-2): R10.2 USB2.A5(CC1)
Net-(R11-2): R11.2 USB2.B5(CC2)

Not connected (* = marked no-connect by the designer): C37 1 2; C38 1 2; C41 1; CN4 A16* A17* B16* B17*; U1 12(COMPP)* 13(COMPN)* 19(COMPO#)* 21(NC)*; U10 3(OUT)* 5(PUSH)*; U22 5(CTS#)*; USB2 A8(SBU1)* B8(SBU2)*

## Notes on the sheets
sheet 1
- 编码器
- 电流采样
- 模拟参考
- CAN
- 收发器
- 电源
- 5V
sheet 3
- USB端口与静电保护
- 5V转3.3V
